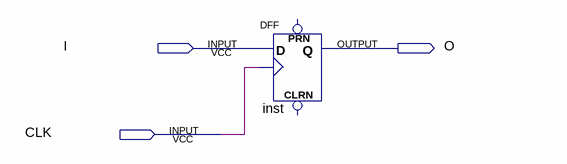
[diagram p0: schematic sheet]
// Quartus schematic Reg1x1.bdf as structural Verilog: 1 symbols, 3 pins
module Reg1x1 (
  input  I,
  input  CLK,
  output O
);

  DFF inst (.CLK(CLK), .D(I), .Q(O));  // open: CLRN, PRN
endmodule
